# Altium project AFE_PCB.PrjPcb
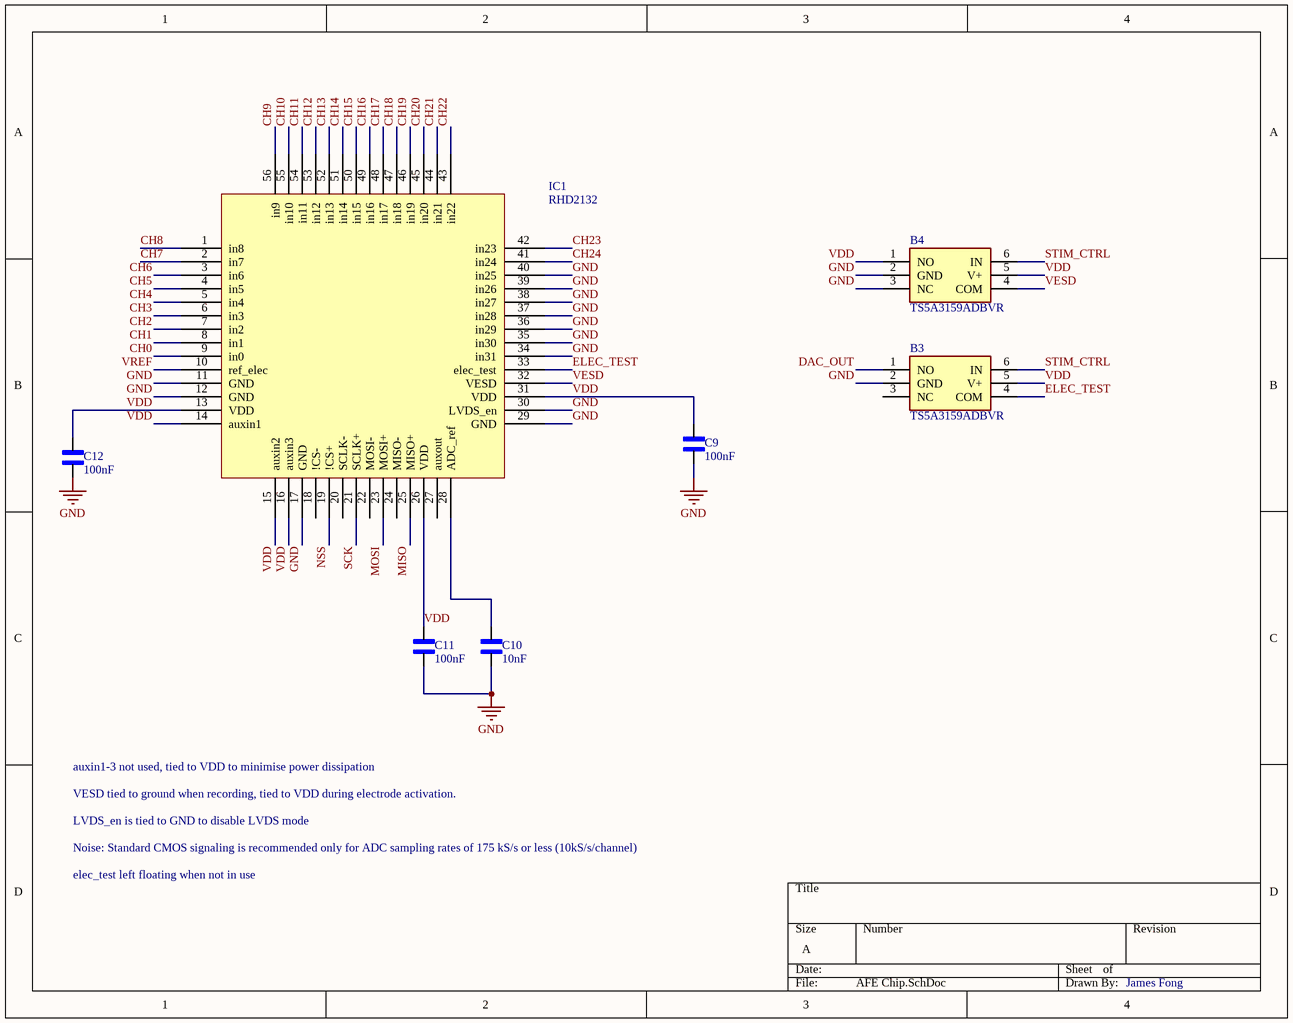
[diagram p0: AFE Chip.SchDoc]
4 sheets, 51 parts. Net scope: global (net labels, ports and power ports of the same name join across sheets).
Board file: Shield.PcbDoc
Sheets:
  AFE Chip.SchDoc
  AFE Shield.SchDoc
  Input Protection.SchDoc
  Power Supply.SchDoc

## Sheet AFE Chip.SchDoc
size A; SheetNumber: 1; SheetTotal: 4

### Parts
B3  TS5A3159ADBVR  [SOT95P280X145-6N]
B4  TS5A3159ADBVR  [SOT95P280X145-6N]
C9  value 100nF  [CAPC2012X88N]  (hidden comment: C0805C104K6RACTU)
C10  value 10nF  [CAPC2012X88N]  (hidden comment: C0805C103J5RACTU)
C11  value 100nF  [CAPC2012X88N]  (hidden comment: C0805C104K6RACTU)
C12  value 100nF  [CAPC2012X88N]  (hidden comment: C0805C104K6RACTU)
IC1  RHD2132  [RHD2216]

### Nets
GND: B3.2(GND) B4.2(GND) B4.3(NC) C9.1 C10.1 C11.1 C12.1 IC1.11(GND) IC1.12(GND) IC1.17(GND) IC1.29(GND) IC1.30(LVDS_en) IC1.34(in31) IC1.35(in30) IC1.36(in29) IC1.37(in28) IC1.38(in27) IC1.39(in26) IC1.40(in25)
CH0: IC1.9(in0)
CH1: IC1.8(in1)
CH2: IC1.7(in2)
CH3: IC1.6(in3)
CH4: IC1.5(in4)
CH5: IC1.4(in5)
CH6: IC1.3(in6)
CH7: IC1.2(in7)
CH8: IC1.1(in8)
CH9: IC1.56(in9)
CH10: IC1.55(in10)
CH11: IC1.54(in11)
CH12: IC1.53(in12)
CH13: IC1.52(in13)
CH14: IC1.51(in14)
CH15: IC1.50(in15)
CH16: IC1.49(in16)
CH17: IC1.48(in17)
CH18: IC1.47(in18)
CH19: IC1.46(in19)
CH20: IC1.45(in20)
CH21: IC1.44(in21)
CH22: IC1.43(in22)
CH23: IC1.42(in23)
CH24: IC1.41(in24)
DAC_OUT: B3.1(NO)
ELEC_TEST: B3.4(COM) IC1.33(elec_test)
MISO: IC1.25(MISO+)
MOSI: IC1.23(MOSI+)
NSS: IC1.19(!CS+)
SCK: IC1.21(SCLK+)
STIM_CTRL: B3.6(IN) B4.6(IN)
VDD: B3.5(V+) B4.1(NO) B4.5(V+) C9.2 C11.2 C12.2 IC1.13(VDD) IC1.14(auxin1) IC1.15(auxin2) IC1.16(auxin3) IC1.26(VDD) IC1.31(VDD)
VESD: B4.4(COM) IC1.32(VESD)
VREF: IC1.10(ref_elec)
NetC10_2: C10.2 IC1.28(ADC_ref)

Not connected (* = marked no-connect by the designer): B3 3(NC); IC1 18(!CS-) 20(SCLK-) 22(MOSI-) 24(MISO-) 27(auxout)

### Notes on the sheet
- auxin1-3 not used, tied to VDD to minimise power dissipation
- LVDS_en is tied to GND to disable LVDS mode
- VESD tied to ground when recording, tied to VDD during electrode activation.
- Noise: Standard CMOS signaling is recommended only for ADC sampling rates of 175 kS/s or less (10kS/s/channel)
- elec_test left floating when not in use
- James Fong

### Library data of the parts
B3 B4 = CMP-011-00015-2: 1 Ohm SPDT Analog Switch 5-V/3.3-V Single Channel 2:1 Multiplexer/Demultiplexer; Manufacturer_Name: Texas Instruments; Geometry.Height: 1.45mm; Source: TS5A3159ADBVR.SchLib; Farnell Price/Stock: *; Farnell Part Number: *; Design Item ID: TS5A3159ADBVR; Datasheet Link: http://www.ti.com/lit/gpn/ts5a3159a; Manufacturer_Part_Number: TS5A3159ADBVR
C9 C11 C12 = CMP-001-00084-1: 0.1 ÂµF Â±10% 35V Ceramic Capacitor X7R 0805 (2012 Metric); MF: KEMET; Source: C0805C104K6RACTU.SchLib; SnapEDA_Link: https://www.snapeda.com/parts/C0805C104K6RACTU/KEMET/view-part/?ref=snap; MP: C0805C104K6RACTU; Pins: 2; Check_prices: https://www.snapeda.com/parts/C0805C104K6RACTU/KEMET/view-part/?ref=eda; Case/Package: 805-2 KEMET; Design Item ID: C0805C104K6RACTU; Component Type: Standard
C10 = CMP-001-00083-1: Capacitor;Ceramic;Cap 0.01uF;Tol 5%;Vol-Rtg 50 V;SMT;Case 0805;X7R;TR; MF: KEMET; Design Item ID: C0805C103J5RACTU; Pins: 2; Source: C0805C103J5RACTU.SchLib; Check_prices: https://www.snapeda.com/parts/C0805C103J5RACTU/KEMET/view-part/?ref=eda; Case/Package: 805-2 KEMET; MP: C0805C103J5RACTU; Component Type: Standard; SnapEDA_Link: https://www.snapeda.com/parts/C0805C103J5RACTU/KEMET/view-part/?ref=snap

## Sheet AFE Shield.SchDoc
size A; SheetNumber: 2; SheetTotal: 4
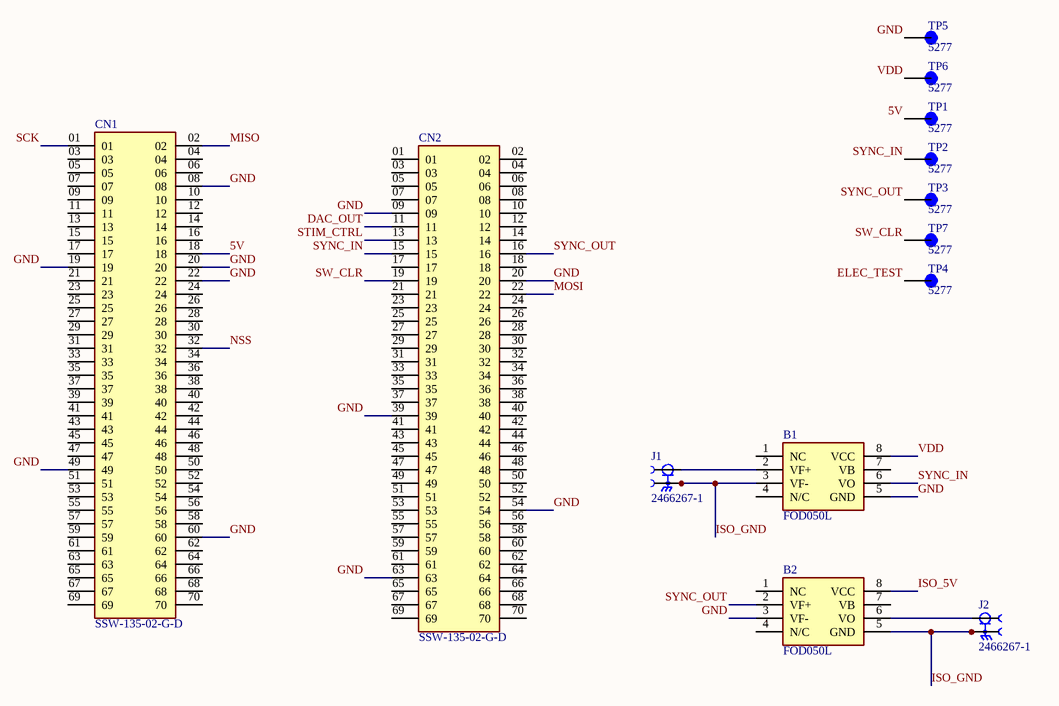
[diagram p1: AFE Shield.SchDoc]

### Parts
B1  FOD050L  [SOIC127P594X363-8N]
B2  FOD050L  [SOIC127P594X363-8N]
CN1  SSW-135-02-G-D  [SAMTEC_SSW-135-02-G-D]
CN2  SSW-135-02-G-D  [SAMTEC_SSW-135-02-G-D]
J1  2466267-1  [TE_2466267-1]
J2  2466267-1  [TE_2466267-1]
TP1  5277  [KEYSTONE_5277]
TP2  5277  [KEYSTONE_5277]
TP3  5277  [KEYSTONE_5277]
TP4  5277  [KEYSTONE_5277]
TP5  5277  [KEYSTONE_5277]
TP6  5277  [KEYSTONE_5277]
TP7  5277  [KEYSTONE_5277]

### Nets
GND: B1.5(GND) B2.3(VF-) CN1.08 CN1.19 CN1.20 CN1.22 CN1.49 CN1.60 CN2.09 CN2.20 CN2.39 CN2.54 CN2.63 TP5.1(TP)
5V: CN1.18 TP1.1(TP)
DAC_OUT: CN2.11
ELEC_TEST: TP4.1(TP)
ISO_5V: B2.8(VCC)
ISO_GND: B1.3(VF-) B2.5(GND) J1.2(SH) J1.3(SH) J1.4(SH) J1.5(SH) J2.2(SH) J2.3(SH) J2.4(SH) J2.5(SH)
MISO: CN1.02
MOSI: CN2.22
NSS: CN1.32
SCK: CN1.01
STIM_CTRL: CN2.13
SW_CLR: CN2.19 TP7.1(TP)
SYNC_IN: B1.6(VO) CN2.15 TP2.1(TP)
SYNC_OUT: B2.2(VF+) CN2.16 TP3.1(TP)
VDD: B1.8(VCC) TP6.1(TP)
NetB1_2: B1.2(VF+) J1.1(SIG)
NetB2_6: B2.6(VO) J2.1(SIG)

Not connected (* = marked no-connect by the designer): B1 1(NC) 4(N/C) 7(VB); B2 1(NC) 4(N/C) 7(VB); CN1 03 04 05 06 07 09 10 11 12 13 14 15 16 17 21 23 24 25 26 27 28 29 30 31 33 34 35 36 37 38 39 40 41 42 43 44 45 46 47 48 50 51 52 53 54 55 56 57 58 59 61 62 63 64 65 66 67 68 69 70; CN2 01 02 03 04 05 06 07 08 10 12 14 17 18 21 23 24 25 26 27 28 29 30 31 32 33 34 35 36 37 38 40 41 42 43 44 45 46 47 48 49 50 51 52 53 55 56 57 58 59 60 61 62 64 65 66 67 68 69 70

### Library data of the parts
B1 B2 = CMP-047-000000-2: DIN-EN/IEC60747-5-5, 565 V Peak Working Insulation Voltage; Safety and Regulatory Approvals:; UL1577, 2,500 VACRMS for 1 Minute; Available in Single-channel 8-pin SOIC (FOD050L) or Dual-channel 8-pin SOIC (FOD053L);; Manufacturer_Name: onsemi; Geometry.Height: 3.63mm; Mouser Part Number: 512-FOD050L; Source: FOD050L.SchLib; Mouser Price/Stock: https://www.mouser.co.uk/ProductDetail/onsemi-Fairchild/FOD050L?qs=ReZUMDdiXnRPjBKyX9bkKw%3D%3D; Design Item ID: FOD050L; Arrow Price/Stock: https://www.arrow.com/en/products/fod050l/on-semiconductor?region=nac; Arrow Part Number: FOD050L; Datasheet Link: https://www.onsemi.com/pub/Collateral/FOD053L-D.PDF; Manufacturer_Part_Number: FOD050L
CN1 CN2 = CMP-066-000000-6: 70-pin connector; MF: Samtec; Source: SSW-135-02-G-D.SchLib; Availability: Unavailable; Price: None; Pin Count: 70; MP: SSW-135-02-G-D; Design Item ID: SSW-135-02-G-D; Package: None; Value: *; Component Type: Standard
J1 J2 = CMP-019-000000-2: BNC connector; Source: 2466267-1.SchLib; MP: 2466267-1; Package: None; Price: None; Component Type: Standard; Availability: Unavailable; Pin Count: 5; Design Item ID: 2466267-1; Value: *
TP1-TP7 = CMP-080-000000-2: TEST POINT (BLUE) - COMPACT; MF: Keystone Electronics; Check_prices: https://www.snapeda.com/parts/5277/Keystone/view-part/?ref=eda; Pin Count: 1; Source: 5277.SchLib; SnapEDA_Link: https://www.snapeda.com/parts/5277/Keystone/view-part/?ref=snap; Package: None; MP: 5277; Component Type: Standard; Value: *; Design Item ID: 5277

## Sheet Input Protection.SchDoc
size A; SheetNumber: 3; SheetTotal: 4
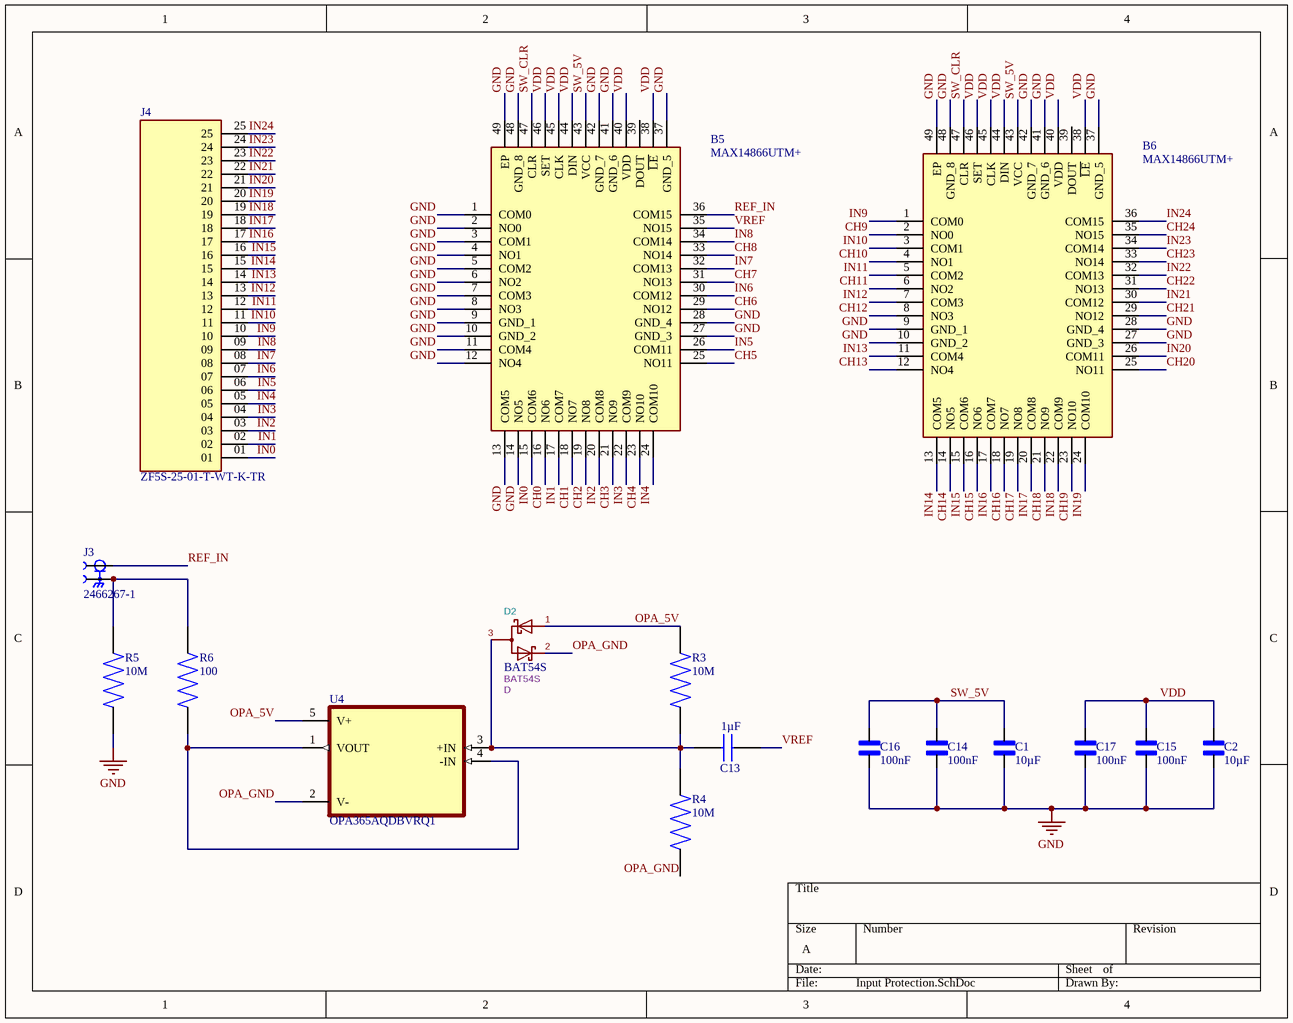
[diagram p2: Input Protection.SchDoc]

### Parts
B5  MAX14866UTM+  [QFN50P700X700X80-49N]
B6  MAX14866UTM+  [QFN50P700X700X80-49N]
C1  value 10µF  [CAPC3225X280N]  (hidden comment: C1210C106K5PACTU)
C2  value 10µF  [CAPC3225X280N]  (hidden comment: C1210C106K5PACTU)
C13  value 1µF  [CAPC7361X470N]  (hidden comment: CB057D0105JBC)
C14  value 100nF  [CAPC2012X88N]  (hidden comment: C0805C104K6RACTU)
C15  value 100nF  [CAPC2012X88N]  (hidden comment: C0805C104K6RACTU)
C16  value 100nF  [CAPC2012X88N]  (hidden comment: C0805C104K6RACTU)
C17  value 100nF  [CAPC2012X88N]  (hidden comment: C0805C104K6RACTU)
D2  BAT54S  Reference: D  [SOT-23]
J3  2466267-1  [TE_2466267-1]
J4  ZF5S-25-01-T-WT-K-TR  [SAMTEC_ZF5S-25-01-T-WT-K-TR]
R3  value 10M  [RESC2012X60N]  (hidden comment: RC0805FR-0710ML)
R4  value 10M  [RESC2012X60N]  (hidden comment: RC0805FR-0710ML)
R5  value 10M  [RESC2012X60N]  (hidden comment: RC0805FR-0710ML)
R6  value 100  [RESC2012X55N]  (hidden comment: MCU08050C1000FP500)
U4  OPA365AQDBVRQ1  [SOT95P280X145-5N]

### Nets
GND: B5.1(COM0) B5.2(NO0) B5.3(COM1) B5.4(NO1) B5.5(COM2) B5.6(NO2) B5.7(COM3) B5.8(NO3) B5.9(GND_1) B5.10(GND_2) B5.11(COM4) B5.12(NO4) B5.13(COM5) B5.14(NO5) B5.27(GND_3) B5.28(GND_4) B5.37(GND_5) B5.41(GND_6) B5.42(GND_7) B5.48(GND_8) B5.49(EP) B6.9(GND_1) B6.10(GND_2) B6.27(GND_3) B6.28(GND_4) B6.37(GND_5) B6.41(GND_6) B6.42(GND_7) B6.48(GND_8) B6.49(EP) C1.2 C2.2 C14.1 C15.1 C16.1 C17.1 R5.2
CH0: B5.16(NO6)
CH1: B5.18(NO7)
CH2: B5.19(NO8)
CH3: B5.21(NO9)
CH4: B5.23(NO10)
CH5: B5.25(NO11)
CH6: B5.29(NO12)
CH7: B5.31(NO13)
CH8: B5.33(NO14)
CH9: B6.2(NO0)
CH10: B6.4(NO1)
CH11: B6.6(NO2)
CH12: B6.8(NO3)
CH13: B6.12(NO4)
CH14: B6.14(NO5)
CH15: B6.16(NO6)
CH16: B6.18(NO7)
CH17: B6.19(NO8)
CH18: B6.21(NO9)
CH19: B6.23(NO10)
CH20: B6.25(NO11)
CH21: B6.29(NO12)
CH22: B6.31(NO13)
CH23: B6.33(NO14)
CH24: B6.35(NO15)
IN0: B5.15(COM6) J4.01
IN1: B5.17(COM7) J4.02
IN2: B5.20(COM8) J4.03
IN3: B5.22(COM9) J4.04
IN4: B5.24(COM10) J4.05
IN5: B5.26(COM11) J4.06
IN6: B5.30(COM12) J4.07
IN7: B5.32(COM13) J4.08
IN8: B5.34(COM14) J4.09
IN9: B6.1(COM0) J4.10
IN10: B6.3(COM1) J4.11
IN11: B6.5(COM2) J4.12
IN12: B6.7(COM3) J4.13
IN13: B6.11(COM4) J4.14
IN14: B6.13(COM5) J4.15
IN15: B6.15(COM6) J4.16
IN16: B6.17(COM7) J4.17
IN17: B6.20(COM8) J4.18
IN18: B6.22(COM9) J4.19
IN19: B6.24(COM10) J4.20
IN20: B6.26(COM11) J4.21
IN21: B6.30(COM12) J4.22
IN22: B6.32(COM13) J4.23
IN23: B6.34(COM14) J4.24
IN24: B6.36(COM15) J4.25
OPA_5V: D2.1(A) R3.1 U4.5(V+)
OPA_GND: D2.2(C) R4.2 U4.2(V-)
REF_IN: B5.36(COM15) J3.1(SIG)
SW_5V: B5.43(VCC) B6.43(VCC) C1.1 C14.2 C16.2
SW_CLR: B5.47(CLR) B6.47(CLR)
VDD: B5.38(~{LE}) B5.40(VDD) B5.44(DIN) B5.45(CLK) B5.46(SET) B6.38(~{LE}) B6.40(VDD) B6.44(DIN) B6.45(CLK) B6.46(SET) C2.1 C15.2 C17.2
VREF: B5.35(NO15) C13.2
NetC13_1: C13.1 D2.3 R3.2 R4.1 U4.3(+IN)
NetJ3_2: J3.2(SH) J3.3(SH) J3.4(SH) J3.5(SH) R5.1 R6.1
NetR6_2: R6.2 U4.1(VOUT) U4.4(-IN)

Not connected (* = marked no-connect by the designer): B5 39(DOUT); B6 39(DOUT)

### Library data of the parts
B5 B6 = CMP-011-00013-2: MAXIM INTEGRATED PRODUCTS - MAX14866UTM+ - ANALOGUE SWITCH, 16 CH, SPST, TQFN-16; Manufacturer_Name: Analog Devices; Geometry.Height: 0.8mm; Arrow Price/Stock: https://www.arrow.com/en/products/max14866utm/analog-devices?utm_currency=USD&region=nac; Design Item ID: MAX14866UTM+; Mouser Part Number: 700-MAX14866UTM+; Source: MAX14866UTM+.SchLib; Arrow Part Number: MAX14866UTM+; Mouser Price/Stock: https://www.mouser.co.uk/ProductDetail/Analog-Devices-Maxim-Integrated/MAX14866UTM%2b?qs=1mbolxNpo8f6nC88ZZmOdg%3D%3D; Manufacturer_Part_Number: MAX14866UTM+; Datasheet Link: https://www.mouser.com/datasheet/2/256/MAX14866-1154497.pdf
C1 C2 = CMP-001-00085-1: 10 ÂµF Â±10% 50V Ceramic Capacitor X5R 1210 (3225 Metric); MF: KEMET; Source: C1210C106K5PACTU.SchLib; Pins: 2; Check_prices: https://www.snapeda.com/parts/C1210C106K5PACTU/KEMET/view-part/?ref=eda; Design Item ID: C1210C106K5PACTU; Component Type: Standard; MP: C1210C106K5PACTU; Case/Package: 3225 KEMET; SnapEDA_Link: https://www.snapeda.com/parts/C1210C106K5PACTU/KEMET/view-part/?ref=snap
C13 = CMP-001-00089-2: 1 F Film Capacitor 40V 63V Polyester, Polyethylene Naphthalate (PEN), Metallized - Stacked 2824 (7260 Metric); Manufacturer_Name: Kyocera AVX; Geometry.Height: 4.7mm; Manufacturer_Part_Number: CB057D0105JBC; Source: CB057D0105JBC.SchLib; Farnell Part Number: *; Design Item ID: CB057D0105JBC; Farnell Price/Stock: *; Datasheet Link: https://datasheets.kyocera-avx.com/cb-pen.pdf
C14-C17 = CMP-001-00084-1: as C9 on sheet AFE Chip; Source: C0805C104K6RACTU.SchLib; SnapEDA_Link: https://www.snapeda.com/parts/C0805C104K6RACTU/KEMET/view-part/?ref=snap; MP: C0805C104K6RACTU; Pins: 2; Check_prices: https://www.snapeda.com/parts/C0805C104K6RACTU/KEMET/view-part/?ref=eda; Case/Package: 805-2 KEMET; Design Item ID: C0805C104K6RACTU; Component Type: Standard
D2 = CMP-004-00037-1: ki_description: Dual Schottky Diode in Series; ki_keywords: Dual Schottky Diode Series; Value: BAT54S; Datasheet: https://diotec.com/request/datasheet/bat54.pdf; Design Item ID: BAT54S; Pins: 3; Component Type: Standard; Source: BAT54S.SchLib
J3 = CMP-019-000000-2: BNC connector; Source: 2466267-1.SchLib; MP: 2466267-1; Package: None; Price: None; Component Type: Standard; Availability: Unavailable; Pin Count: 5; Design Item ID: 2466267-1; Value: *
J4 = CMP-084-000000-2: 25 Conductor ZIF connector; Pin Count: 25; MP: ZF5S-25-01-T-WT-K-TR; Design Item ID: ZF5S-25-01-T-WT-K-TR; Price: None; Source: ZF5S-25-01-T-WT-K-TR.SchLib; Value: *; Component Type: Standard; Availability: Unavailable; Package: None
R3-R5 = CMP-009-00180-1: 10 MOhms Â±1% 0.125W, 1/8W Chip Resistor 0805 (2012 Metric) Moisture Resistant Thick Film; MF: Yageo; SnapEDA_Link: https://www.snapeda.com/parts/RC0805FR-0710ML/Yageo/view-part/?ref=snap; Design Item ID: RC0805FR-0710ML; Pins: 2; MP: RC0805FR-0710ML; Component Type: Standard; Source: RC0805FR-0710ML.SchLib; Case/Package: 2012 Yageo; Check_prices: https://www.snapeda.com/parts/RC0805FR-0710ML/Yageo/view-part/?ref=eda
R6 = CMP-009-00181-1: Res Thin Film 0805 100 Ohm 1% 0.125W(1/8W) ?50ppm/C Molded SMD Automotive Medical Paper T/R; MF: Vishay Beyschlag; Case/Package: 2012 Vishay; SnapEDA_Link: https://www.snapeda.com/parts/MCU08050C1000FP500/Vishay/view-part/?ref=snap; Check_prices: https://www.snapeda.com/parts/MCU08050C1000FP500/Vishay/view-part/?ref=eda; Component Type: Standard; Pins: 2; Design Item ID: MCU08050C1000FP500; MP: MCU08050C1000FP500; Source: MCU08050C1000FP500.SchLib
U4 = CMP-014-00002-1: Automotive 2.2V, 50MHz, Low-Noise, Single-Supply Rail-to-Rail Operational Amplifier; MF: Texas Instruments; Design Item ID: OPA365AQDBVRQ1; Source: OPA365AQDBVRQ1.SchLib; Component Type: Standard; Case/Package: SOT-23-5 Texas Instruments; Pins: 5; Value: *; MP: OPA365AQDBVRQ1; Check_prices: https://www.snapeda.com/parts/OPA365AQDBVRQ1/Texas+Instruments/view-part/?ref=eda; SnapEDA_Link: https://www.snapeda.com/parts/OPA365AQDBVRQ1/Texas+Instruments/view-part/?ref=snap

## Sheet Power Supply.SchDoc
size A; SheetNumber: 4; SheetTotal: 4
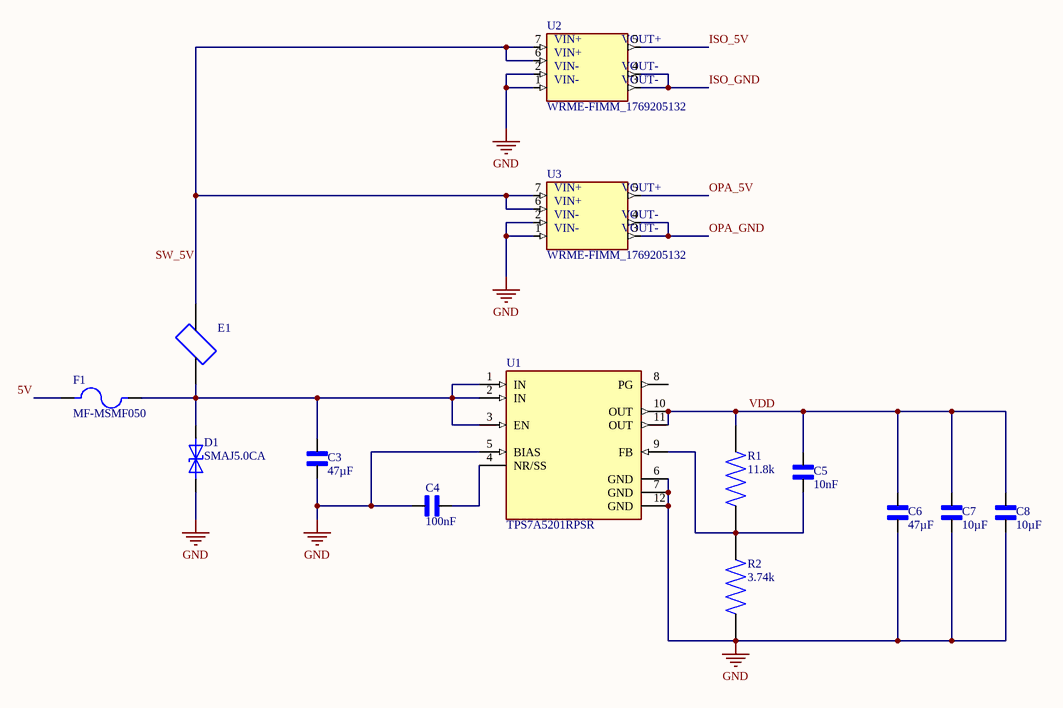
[diagram p3: Power Supply.SchDoc]

### Parts
C3  value 47µF  [CAPC3225X270N]  (hidden comment: CL32B476KPJNNWE)
C4  value 100nF  [CAPC2012X88N]  (hidden comment: C0805C104K6RACTU)
C5  value 10nF  [CAPC2012X88N]  (hidden comment: C0805C103J5RACTU)
C6  value 47µF  [CAPC3225X270N]  (hidden comment: CL32B476KPJNNWE)
C7  value 10µF  [CAPC3225X280N]  (hidden comment: C1210C106K5PACTU)
C8  value 10µF  [CAPC3225X280N]  (hidden comment: C1210C106K5PACTU)
D1  SMAJ5.0CA  [DIOM5126X229N]
E1  2-2176744-2  [BEADC2012X110N]  (value not drawn)
F1  MF-MSMF050  [FUSER_MF-MSMF050]
R1  value 11.8k  [RESC2012X50N]  (hidden comment: CRCW080511K8FKEC)
R2  value 3.74k  [RESC2012X50N]  (hidden comment: CRCW08053K74FKEA)
U1  TPS7A5201RPSR  [IC_TPS7A5201RPSR]
U2  WRME-FIMM_1769205132  [WRME-FIMM_1769205132]
U3  WRME-FIMM_1769205132  [WRME-FIMM_1769205132]

### Nets
GND: C3.2 C4.2 C6.2 C7.2 C8.2 D1.2 R2.2 U1.5(BIAS) U1.6(GND) U1.7(GND) U1.12(GND) U2.1 U2.2 U3.1 U3.2
5V: F1.1
ISO_5V: U2.5
ISO_GND: U2.3 U2.4
OPA_5V: U3.5
OPA_GND: U3.3 U3.4
SW_5V: E1.2 U2.6 U2.7 U3.6 U3.7
VDD: C5.2 C6.1 C7.1 C8.1 R1.1 U1.10(OUT) U1.11(OUT)
NetC3_1: C3.1 D1.1 E1.1 F1.2 U1.1(IN) U1.2(IN) U1.3(EN)
NetC4_1: C4.1 U1.4(NR/SS)
NetC5_1: C5.1 R1.2 R2.1 U1.9(FB)

Not connected (* = marked no-connect by the designer): U1 8(PG)

### Notes on the sheet
- (in symbol CMP-069-000000-2) VIN+; VOUT+; VIN-; VOUT-

### Library data of the parts
C3 C6 = CMP-001-00086-1: 47 ÂµF Â±10% 10V Ceramic Capacitor X7R 1210 (3225 Metric); MF: Samsung; Design Item ID: CL32B476KPJNNWE; Check_prices: https://www.snapeda.com/parts/CL32B476KPJNNWE/Samsung/view-part/?ref=eda; Source: CL32B476KPJNNWE.SchLib; Pins: 2; MP: CL32B476KPJNNWE; Component Type: Standard; Case/Package: SMD-2 Samsung; SnapEDA_Link: https://www.snapeda.com/parts/CL32B476KPJNNWE/Samsung/view-part/?ref=snap
C4 = CMP-001-00084-1: as C9 on sheet AFE Chip; Source: C0805C104K6RACTU.SchLib; SnapEDA_Link: https://www.snapeda.com/parts/C0805C104K6RACTU/KEMET/view-part/?ref=snap; MP: C0805C104K6RACTU; Pins: 2; Check_prices: https://www.snapeda.com/parts/C0805C104K6RACTU/KEMET/view-part/?ref=eda; Case/Package: 805-2 KEMET; Design Item ID: C0805C104K6RACTU; Component Type: Standard
C5 = CMP-001-00083-1: as C10 on sheet AFE Chip; Design Item ID: C0805C103J5RACTU; Pins: 2; Source: C0805C103J5RACTU.SchLib; Check_prices: https://www.snapeda.com/parts/C0805C103J5RACTU/KEMET/view-part/?ref=eda; Case/Package: 805-2 KEMET; MP: C0805C103J5RACTU; Component Type: Standard; SnapEDA_Link: https://www.snapeda.com/parts/C0805C103J5RACTU/KEMET/view-part/?ref=snap
C7 C8 = CMP-001-00085-1: as C1 on sheet Input Protection; Source: C1210C106K5PACTU.SchLib; Pins: 2; Check_prices: https://www.snapeda.com/parts/C1210C106K5PACTU/KEMET/view-part/?ref=eda; Design Item ID: C1210C106K5PACTU; Component Type: Standard; MP: C1210C106K5PACTU; Case/Package: 3225 KEMET; SnapEDA_Link: https://www.snapeda.com/parts/C1210C106K5PACTU/KEMET/view-part/?ref=snap
D1 = CMP-004-00032-1: A 5.0V, 400W, bi-directional, SMA pkg TVS Diode; MF: Bourns; Pins: 2; SnapEDA_Link: https://www.snapeda.com/parts/SMAJ5.0CA/Bourns/view-part/?ref=snap; Design Item ID: SMAJ5.0CA; Source: SMAJ5.0CA.SchLib; Value: *; MP: SMAJ5.0CA; Case/Package: DO-214 Bourns; Check_prices: https://www.snapeda.com/parts/SMAJ5.0CA/Bourns/view-part/?ref=eda; Component Type: Standard
E1 = CMP-006-00023-2: 600 Ohms @ 100 MHz 1 Power Line Ferrite Bead 0805 (2012 Metric) 1.5A 250mOhm; MF: TE Connectivity Passive Product; SnapEDA_Link: https://www.snapeda.com/parts/2-2176744-2/TE/view-part/?ref=snap; Pins: 2; Case/Package: None; MP: 2-2176744-2; Source: 2-2176744-2.SchLib; Design Item ID: 2-2176744-2; Check_prices: https://www.snapeda.com/parts/2-2176744-2/TE/view-part/?ref=eda; Component Type: Standard
F1 = CMP-005-00013-1: Polymeric PTC Resettable Fuse 40V 500 mA Ih Surface Mount 1812 (4532 Metric), Concave; MF: Bourns; SnapEDA_Link: https://www.snapeda.com/parts/MF-MSMF050/Bourns/view-part/?ref=snap; Value: *; Component Type: Standard; Price: None; Check_prices: https://www.snapeda.com/parts/MF-MSMF050/Bourns/view-part/?ref=eda; Case/Package: 1812 Bourns; Availability: Not in stock; Pins: 2; Source: MF-MSMF050.SchLib; MP: MF-MSMF050; Design Item ID: MF-MSMF050
R1 = CMP-009-00177-1: Res Thick Film 0805 11.8K Ohm 1% 0.125W(1/8W) Â±100ppm/C Molded SMD Automotive Paper T/R; MF: Vishay; SnapEDA_Link: https://www.snapeda.com/parts/CRCW080511K8FKEC/Vishay/view-part/?ref=snap; Component Type: Standard; Check_prices: https://www.snapeda.com/parts/CRCW080511K8FKEC/Vishay/view-part/?ref=eda; Case/Package: 2012 Vishay; Source: CRCW080511K8FKEC.SchLib; Pins: 2; Design Item ID: CRCW080511K8FKEC; MP: CRCW080511K8FKEC
R2 = CMP-009-00178-1: Resistor;Thick Film;3.74 Kilohms;0.125 W;1%;SMT;0805;TCR 37 ppm/DegC;TR; MF: Vishay Dale; SnapEDA_Link: https://www.snapeda.com/parts/CRCW08053K74FKEA/Vishay+Dale/view-part/?ref=snap; Component Type: Standard; Source: CRCW08053K74FKEA.SchLib; Pins: 2; Check_prices: https://www.snapeda.com/parts/CRCW08053K74FKEA/Vishay+Dale/view-part/?ref=eda; Case/Package: 2012 Vishay; Design Item ID: CRCW08053K74FKEA; MP: CRCW08053K74FKEA
U1 = CMP-031-000000-2: LDO; MF: {'manufacturer': u'Texas Instruments'}; Package: None; Source: TPS7A5201RPSR.SchLib; MP: TPS7A5201RPSR; Pin Count: 12; Value: *; Availability: Unavailable; Component Type: Standard; Design Item ID: TPS7A5201RPSR; Price: None
U2 U3 = CMP-069-000000-2: LGA-7 / 5Vin / 5Vout / 1W / 3kV / 9 x 7 x 3.1mm / short circuit protection; MF: Wurth Elektronik; Package: None; Check_prices: https://www.snapeda.com/parts/1769205132/Wurth+Electronics/view-part/?ref=eda; MP: 1769205132; Design Item ID: WRME-FIMM_1769205132; Source: WRME-FIMM_1769205132.SchLib; Pin Count: 7; Component Type: Standard; Value: *; SnapEDA_Link: https://www.snapeda.com/parts/1769205132/Wurth+Electronics/view-part/?ref=snap

## Nets that join several sheets
GND: AFE Chip (19 pins), AFE Shield (14 pins), Input Protection (37 pins), Power Supply (15 pins)
5V: AFE Shield (CN1.18 TP1.1), Power Supply (F1.1)
CH0: AFE Chip (IC1.9), Input Protection (B5.16)
CH1: AFE Chip (IC1.8), Input Protection (B5.18)
CH2: AFE Chip (IC1.7), Input Protection (B5.19)
CH3: AFE Chip (IC1.6), Input Protection (B5.21)
CH4: AFE Chip (IC1.5), Input Protection (B5.23)
CH5: AFE Chip (IC1.4), Input Protection (B5.25)
CH6: AFE Chip (IC1.3), Input Protection (B5.29)
CH7: AFE Chip (IC1.2), Input Protection (B5.31)
CH8: AFE Chip (IC1.1), Input Protection (B5.33)
CH9: AFE Chip (IC1.56), Input Protection (B6.2)
CH10: AFE Chip (IC1.55), Input Protection (B6.4)
CH11: AFE Chip (IC1.54), Input Protection (B6.6)
CH12: AFE Chip (IC1.53), Input Protection (B6.8)
CH13: AFE Chip (IC1.52), Input Protection (B6.12)
CH14: AFE Chip (IC1.51), Input Protection (B6.14)
CH15: AFE Chip (IC1.50), Input Protection (B6.16)
CH16: AFE Chip (IC1.49), Input Protection (B6.18)
CH17: AFE Chip (IC1.48), Input Protection (B6.19)
CH18: AFE Chip (IC1.47), Input Protection (B6.21)
CH19: AFE Chip (IC1.46), Input Protection (B6.23)
CH20: AFE Chip (IC1.45), Input Protection (B6.25)
CH21: AFE Chip (IC1.44), Input Protection (B6.29)
CH22: AFE Chip (IC1.43), Input Protection (B6.31)
CH23: AFE Chip (IC1.42), Input Protection (B6.33)
CH24: AFE Chip (IC1.41), Input Protection (B6.35)
DAC_OUT: AFE Chip (B3.1), AFE Shield (CN2.11)
ELEC_TEST: AFE Chip (B3.4 IC1.33), AFE Shield (TP4.1)
ISO_5V: AFE Shield (B2.8), Power Supply (U2.5)
ISO_GND: AFE Shield (10 pins), Power Supply (U2.3 U2.4)
MISO: AFE Chip (IC1.25), AFE Shield (CN1.02)
MOSI: AFE Chip (IC1.23), AFE Shield (CN2.22)
NSS: AFE Chip (IC1.19), AFE Shield (CN1.32)
OPA_5V: Input Protection (D2.1 R3.1 U4.5), Power Supply (U3.5)
OPA_GND: Input Protection (D2.2 R4.2 U4.2), Power Supply (U3.3 U3.4)
SCK: AFE Chip (IC1.21), AFE Shield (CN1.01)
STIM_CTRL: AFE Chip (B3.6 B4.6), AFE Shield (CN2.13)
SW_5V: Input Protection (5 pins), Power Supply (5 pins)
SW_CLR: AFE Shield (CN2.19 TP7.1), Input Protection (B5.47 B6.47)
VDD: AFE Chip (12 pins), AFE Shield (B1.8 TP6.1), Input Protection (13 pins), Power Supply (7 pins)
VREF: AFE Chip (IC1.10), Input Protection (B5.35 C13.2)